# EAGLE schematic main (EAGLE 7.3.0)
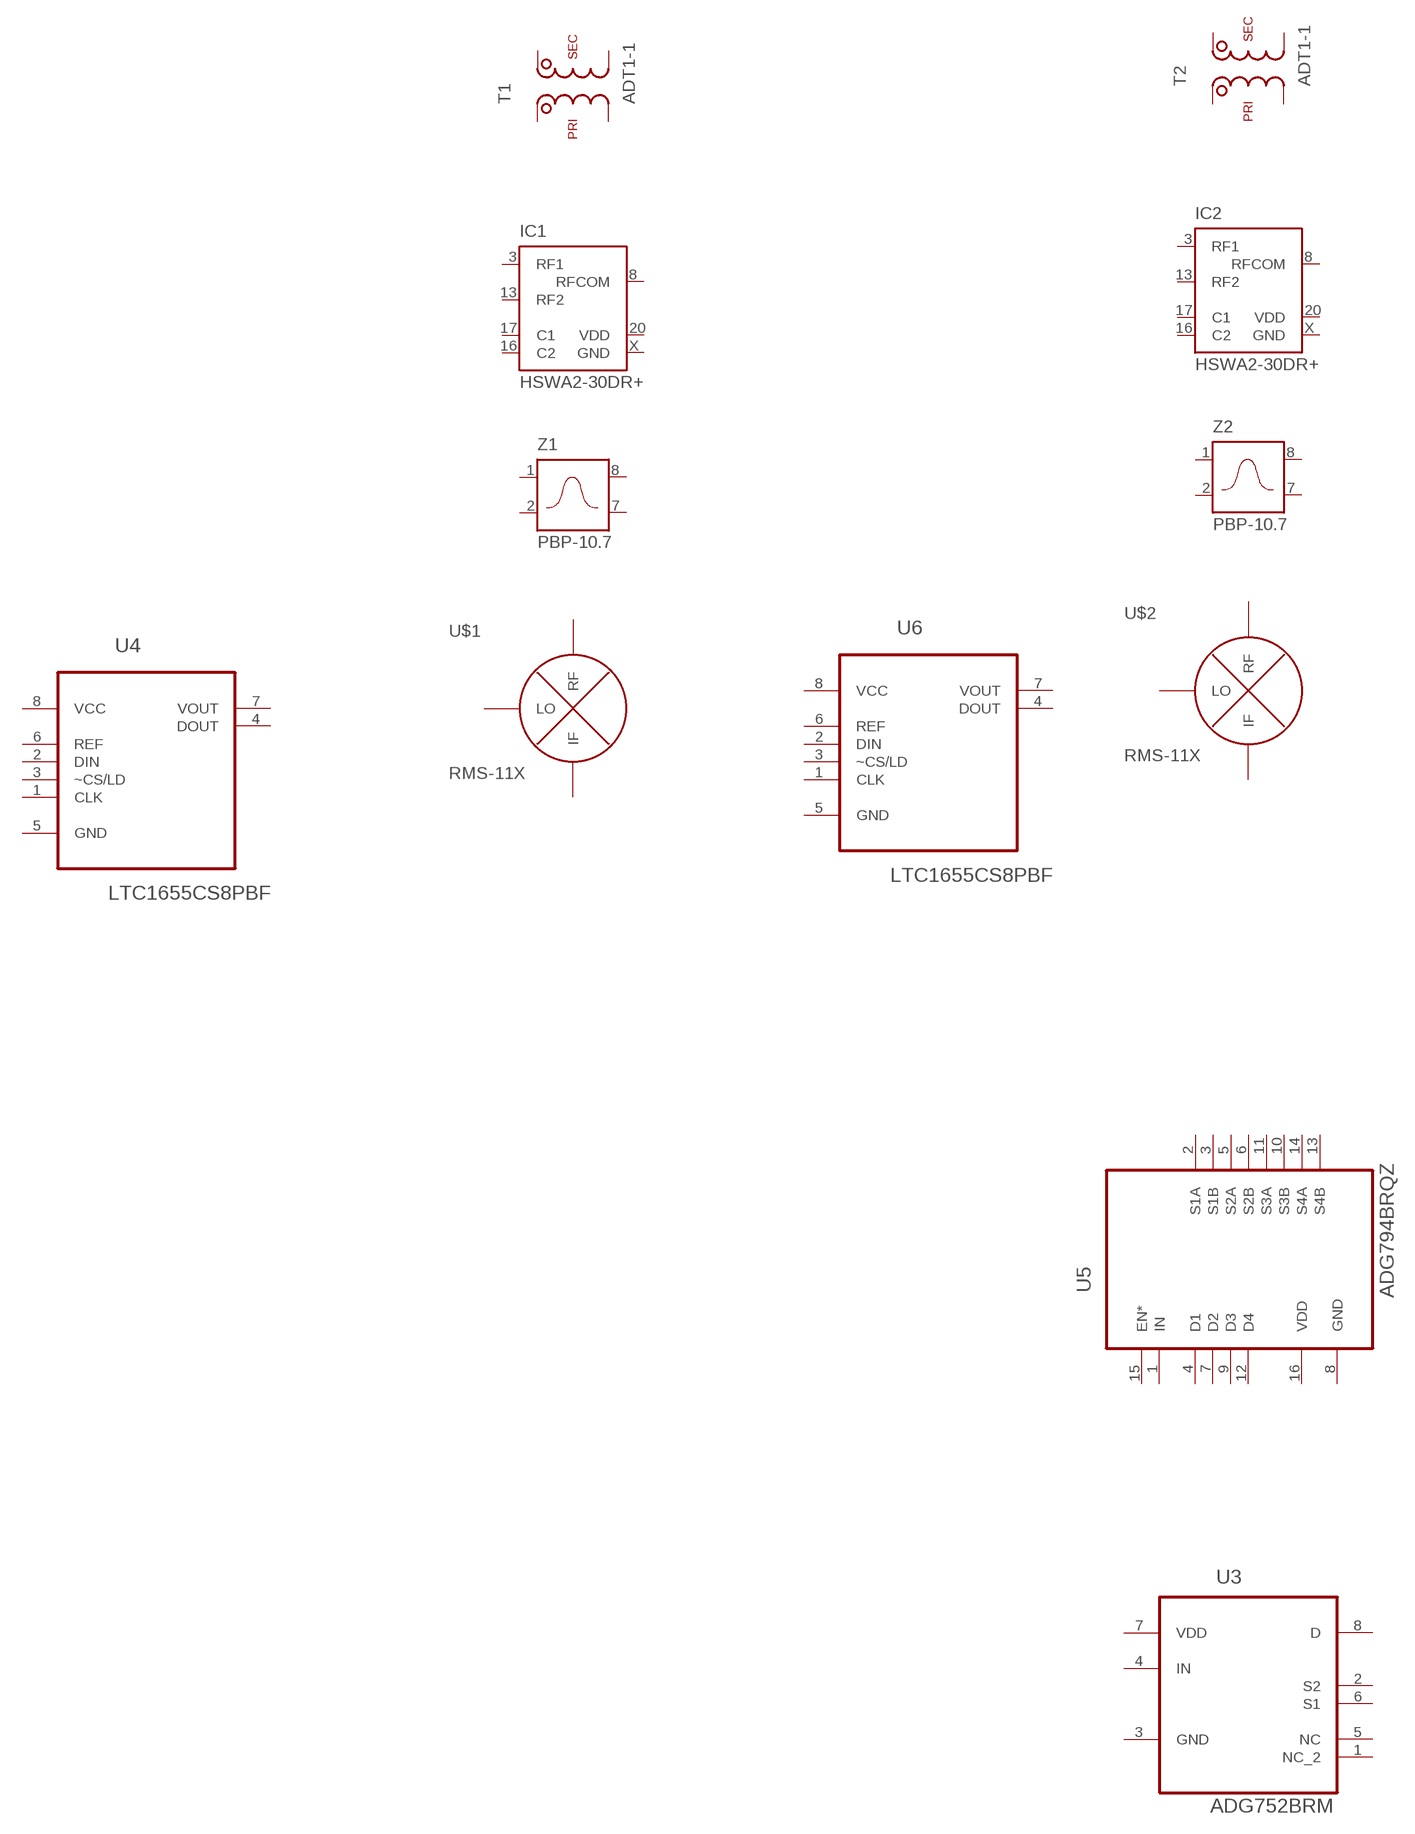
[diagram p0: schematic, sheet 1, part 1 of 3]
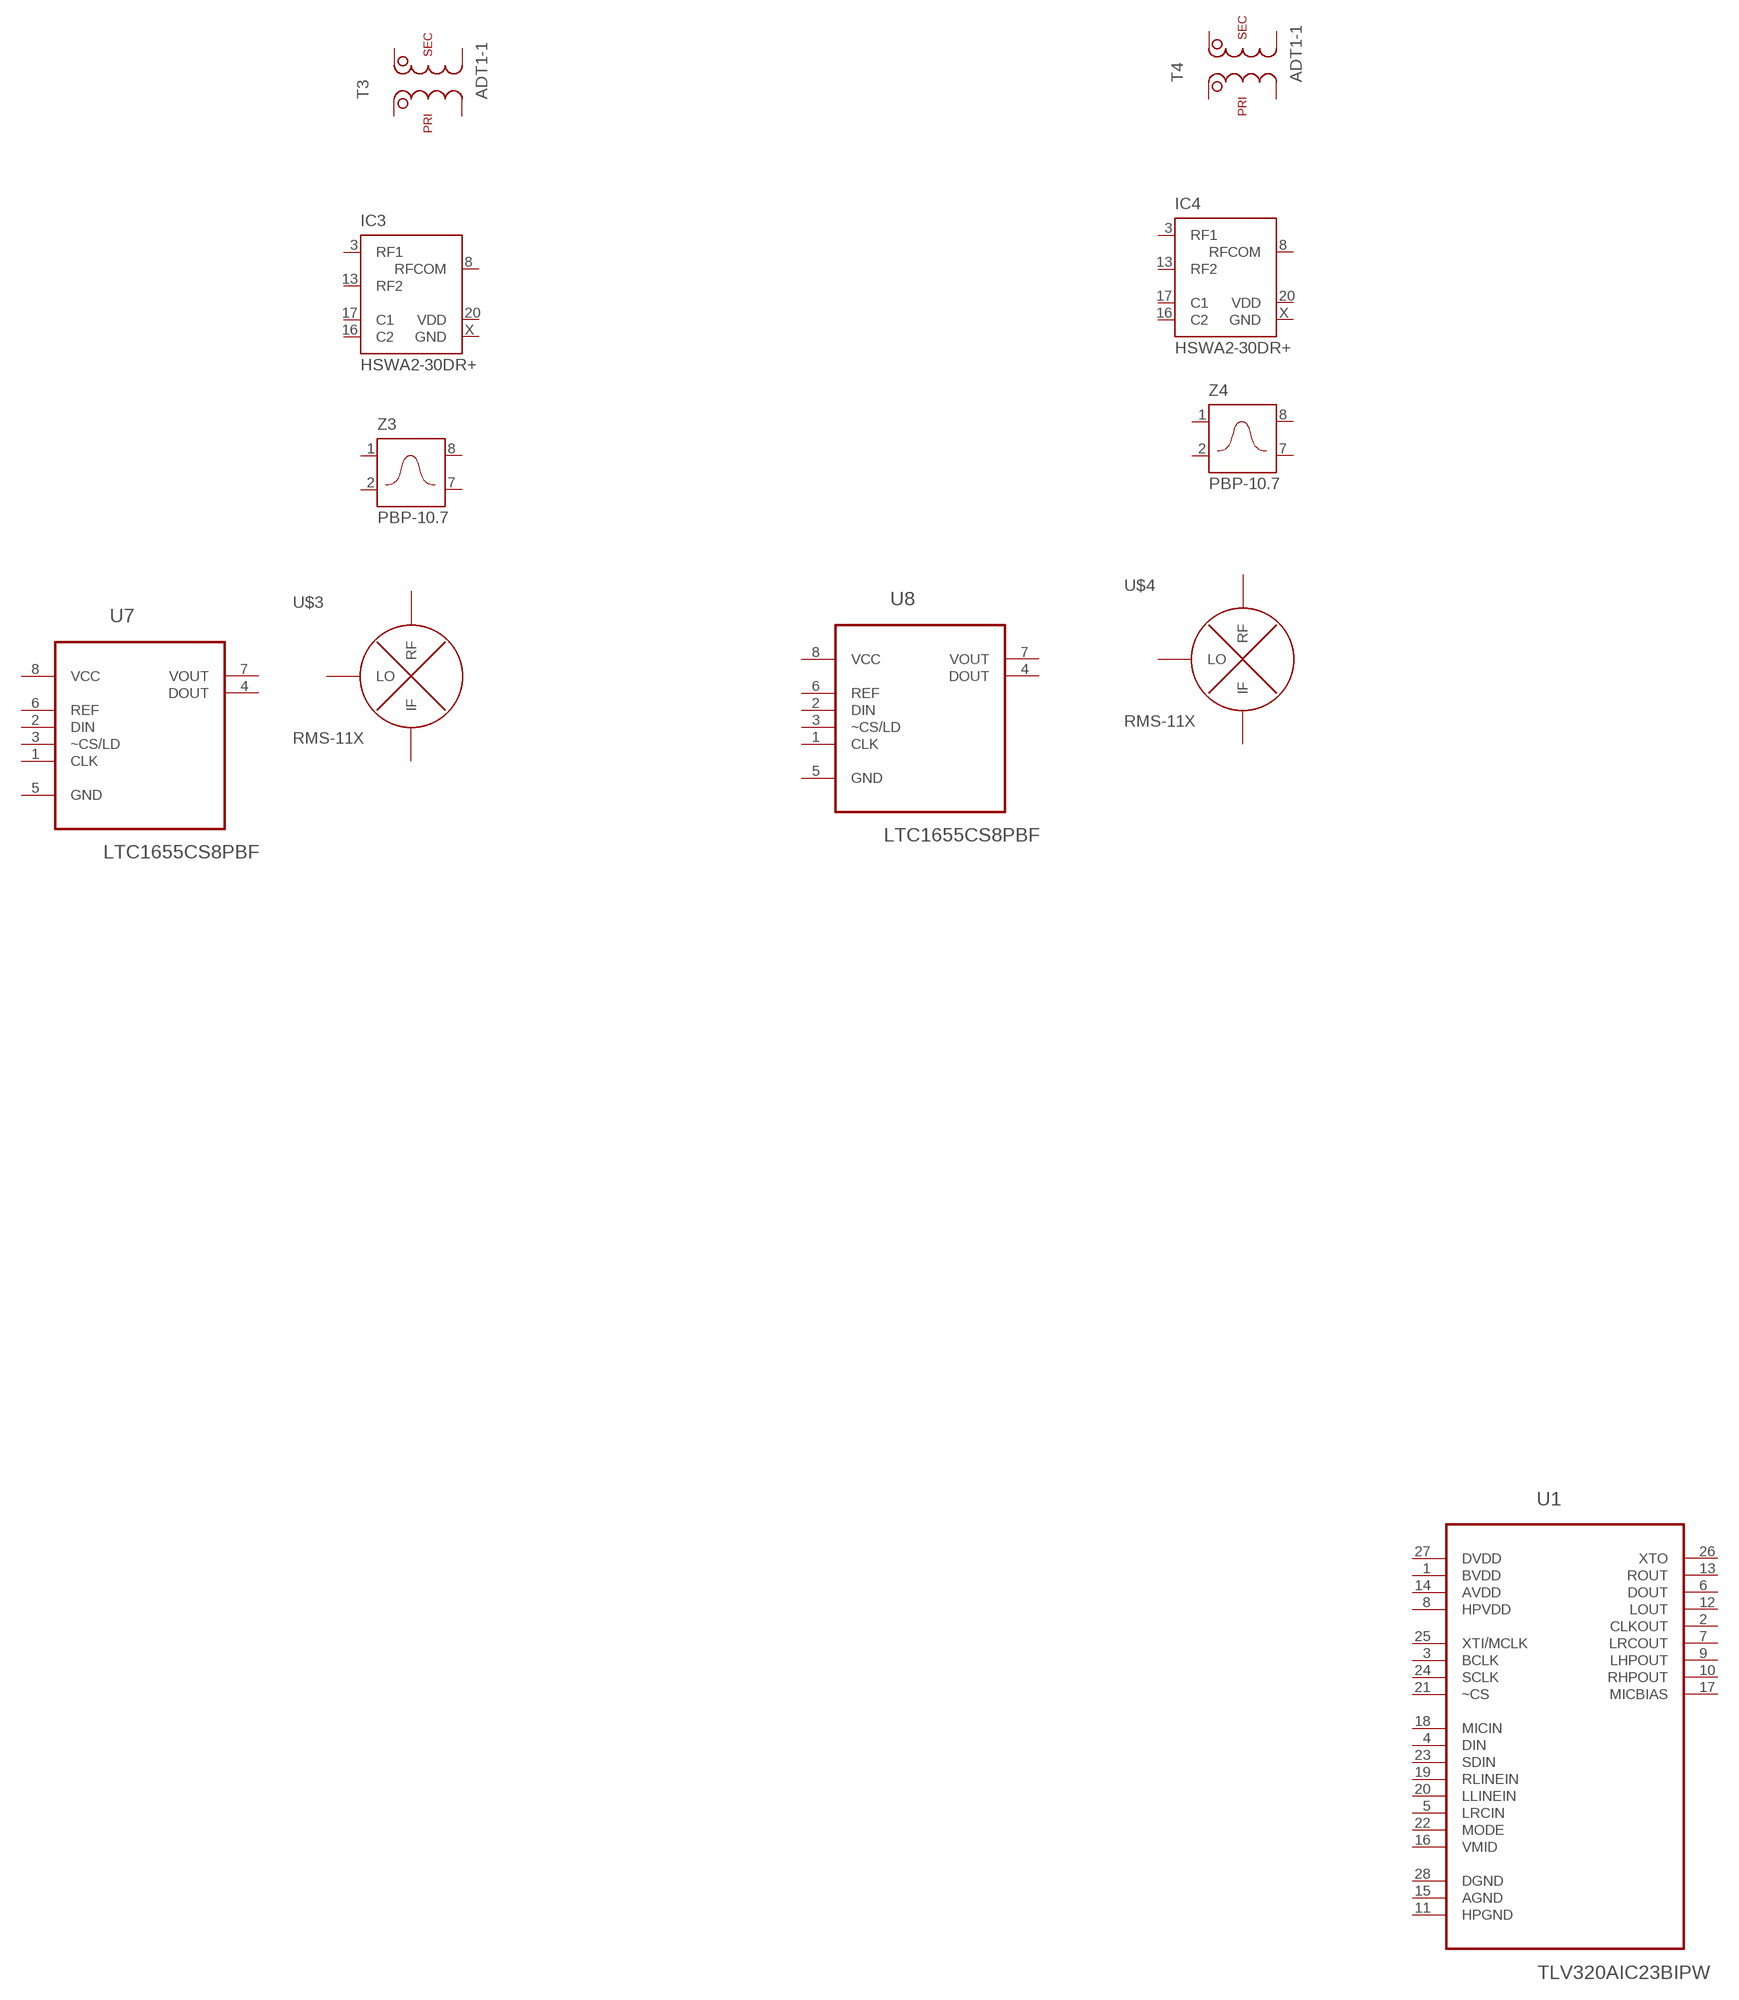
[diagram p1: schematic, sheet 1, part 2 of 3]
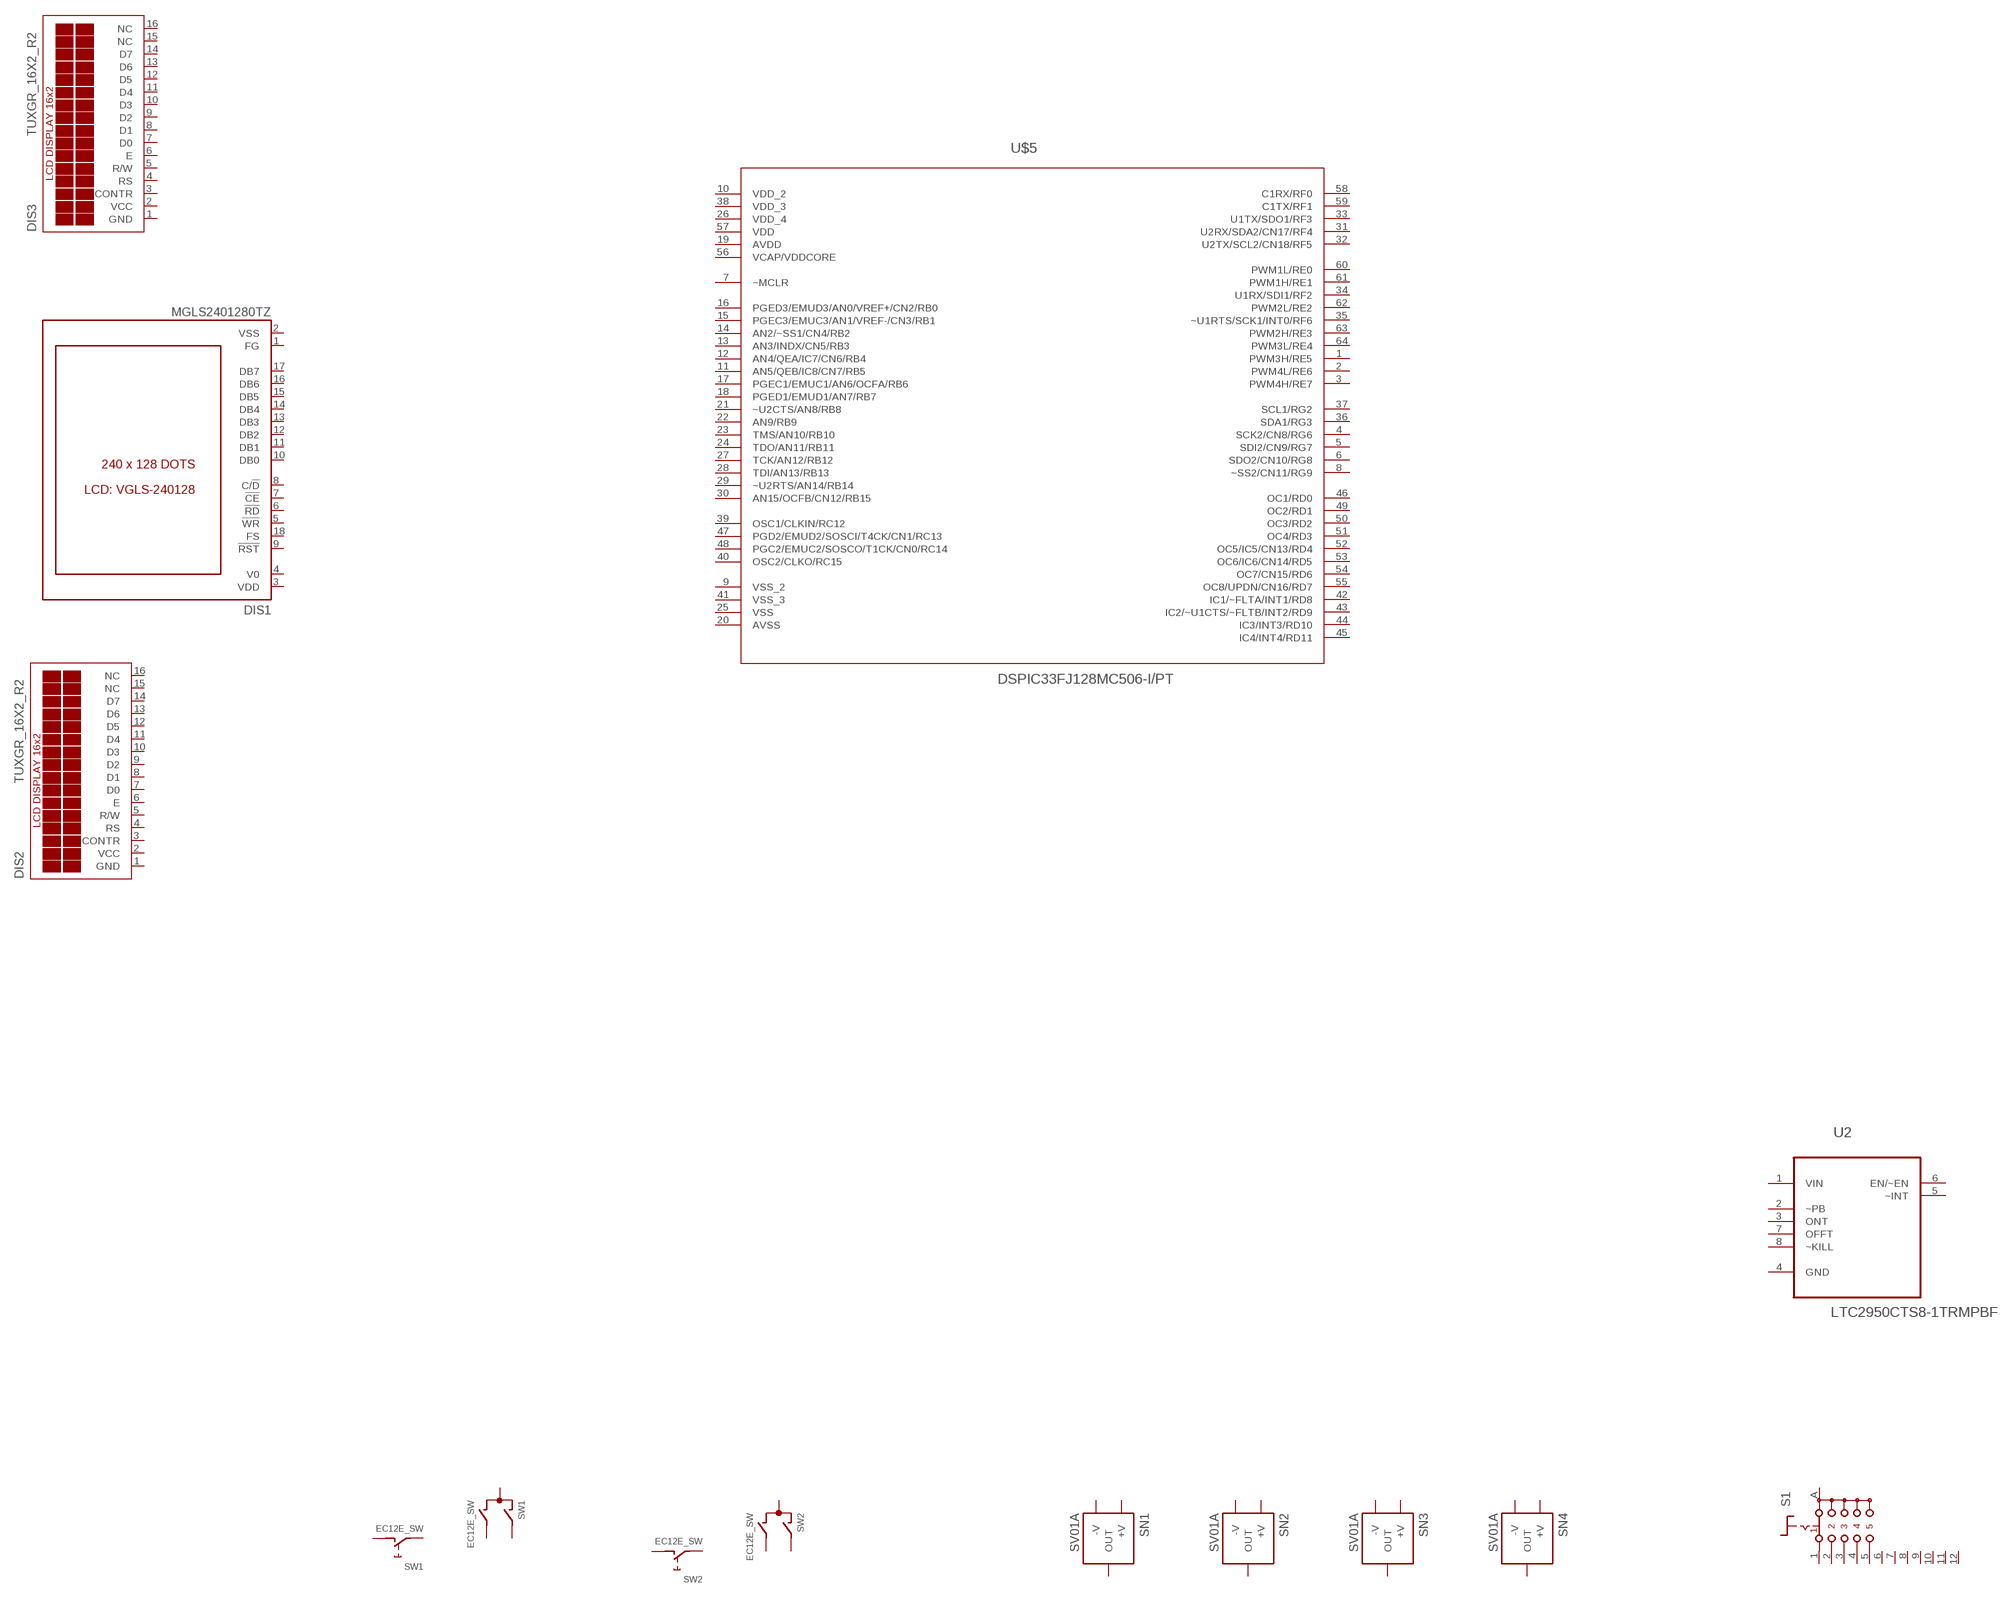
[diagram p2: schematic, sheet 1, part 3 of 3]

## Parts
DIS1  MGLS2401280TZ  [MGLS2401280TZ]
DIS2  TUXGR_16X2_R2  [TUXGR_16X2_R2]
DIS3  TUXGR_16X2_R2  [TUXGR_16X2_R2]
IC1  HSWA2-30DR+  [DG983-1]
IC2  HSWA2-30DR+  [DG983-1]
IC3  HSWA2-30DR+  [DG983-1]
IC4  HSWA2-30DR+  [DG983-1]
S1  CK101X12  [CK101X12]
SN1  SV01A  [SV01A]
SN2  SV01A  [SV01A]
SN3  SV01A  [SV01A]
SN4  SV01A  [SV01A]
SW1  EC12E_SW  [ALPS_EC12E_SW]
SW2  EC12E_SW  [ALPS_EC12E_SW]
T1  ADT1-1  [CD542]
T2  ADT1-1  [CD542]
T3  ADT1-1  [CD542]
T4  ADT1-1  [CD542]
U1  TLV320AIC23BIPW  [SOP65P640X120-28N]
U2  LTC2950CTS8-1TRMPBF  [SOT65P280X100-8N]
U3  ADG752BRM  [SOP65P490X110-8N]
U4  LTC1655CS8PBF  [SOIC127P600X175-8N]
U5  ADG794BRQZ  [SOP635P600X190-16N]
U6  LTC1655CS8PBF  [SOIC127P600X175-8N]
U7  LTC1655CS8PBF  [SOIC127P600X175-8N]
U8  LTC1655CS8PBF  [SOIC127P600X175-8N]
U$1  RMS-11X  [TT240]
U$2  RMS-11X  [TT240]
U$3  RMS-11X  [TT240]
U$4  RMS-11X  [TT240]
U$5  DSPIC33FJ128MC506-I/PT  [QFP80P1200X1200X120-64N]
Z1  PBP-10.7  [A01]
Z2  PBP-10.7  [A01]
Z3  PBP-10.7  [A01]
Z4  PBP-10.7  [A01]
Unconnected: DIS1.1(FG) DIS1.2(VSS) DIS1.3(VDD) DIS1.4(V0) DIS1.5(!WR) DIS1.6(!RD) DIS1.7(!CE) DIS1.8(C/!D) DIS1.9(!RST) DIS1.10(DB0) DIS1.11(DB1) DIS1.12(DB2) DIS1.13(DB3) DIS1.14(DB4) DIS1.15(DB5) DIS1.16(DB6) DIS1.17(DB7) DIS1.18(FS) DIS2.3(CONTR) DIS2.4(RS) DIS2.5(R/W) DIS2.6(E) DIS2.7(D0) DIS2.8(D1) DIS2.9(D2) DIS2.10(D3) DIS2.11(D4) DIS2.12(D5) DIS2.13(D6) DIS2.14(D7) DIS2.15(NC) DIS2.16(NC) DIS3.3(CONTR) DIS3.4(RS) DIS3.5(R/W) DIS3.6(E) DIS3.7(D0) DIS3.8(D1) DIS3.9(D2) DIS3.10(D3) DIS3.11(D4) DIS3.12(D5) DIS3.13(D6) DIS3.14(D7) DIS3.15(NC) DIS3.16(NC) IC1.3(RF1) IC1.8(RFCOM) IC1.13(RF2) IC1.16(C2) IC1.17(C1) IC1.20(VDD) IC2.3(RF1) IC2.8(RFCOM) IC2.13(RF2) IC2.16(C2) IC2.17(C1) IC2.20(VDD) IC3.3(RF1) IC3.8(RFCOM) IC3.13(RF2) IC3.16(C2) IC3.17(C1) IC3.20(VDD) IC4.3(RF1) IC4.8(RFCOM) IC4.13(RF2) IC4.16(C2) IC4.17(C1) IC4.20(VDD) S1.1 S1.2 S1.3 S1.4 S1.5 S1.6 S1.7 S1.8 S1.9 S1.10 S1.11 S1.12 S1.A SN1.1(-V) SN1.2(OUT) SN1.3(+V) SN2.1(-V) SN2.2(OUT) SN2.3(+V) SN3.1(-V) SN3.2(OUT) SN3.3(+V) SN4.1(-V) SN4.2(OUT) SN4.3(+V) SW1.A SW1.B SW1.C SW1.D SW1.E SW1.GND1(G) SW1.GND2(G) SW2.A SW2.B SW2.C SW2.D SW2.E SW2.GND1(G) SW2.GND2(G) T1.1(P2) T1.2(NC) T1.3(P1) T1.4(S1) T1.5(NC) T1.6(S2) T2.1(P2) T2.2(NC) T2.3(P1) T2.4(S1) T2.5(NC) T2.6(S2) T3.1(P2) T3.2(NC) T3.3(P1) T3.4(S1) T3.5(NC) T3.6(S2) T4.1(P2) T4.2(NC) T4.3(P1) T4.4(S1) T4.5(NC) T4.6(S2) U1.2(CLKOUT) U1.3(BCLK) U1.4(DIN) U1.5(LRCIN) U1.6(DOUT) U1.7(LRCOUT) U1.9(LHPOUT) U1.10(RHPOUT) U1.11(HPGND) U1.12(LOUT) U1.13(ROUT) U1.16(VMID) U1.17(MICBIAS) U1.18(MICIN) U1.19(RLINEIN) U1.20(LLINEIN) U1.21(~CS) U1.22(MODE) U1.23(SDIN) U1.24(SCLK) U1.25(XTI/MCLK) U1.26(XTO) U1.28(DGND) U2.2(~PB) U2.3(ONT) U2.4(GND) U2.5(~INT) U2.6(EN/~EN) U2.7(OFFT) U2.8(~KILL) U3.1(NC_2) U3.2(S2) U3.3(GND) U3.4(IN) U3.5(NC) U3.6(S1) U3.8(D) U4.1(CLK) U4.2(DIN) U4.3(~CS/LD) U4.4(DOUT) U4.5(GND) U4.6(REF) U4.7(VOUT) U5.1(IN) U5.2(S1A) U5.3(S1B) U5.4(D1) U5.5(S2A) U5.6(S2B) U5.7(D2) U5.8(GND) U5.9(D3) U5.10(S3B) U5.11(S3A) U5.12(D4) U5.13(S4B) U5.14(S4A) U5.15(EN*) U6.1(CLK) U6.2(DIN) U6.3(~CS/LD) U6.4(DOUT) U6.5(GND) U6.6(REF) U6.7(VOUT) U7.1(CLK) U7.2(DIN) U7.3(~CS/LD) U7.4(DOUT) U7.5(GND) U7.6(REF) U7.7(VOUT) U8.1(CLK) U8.2(DIN) U8.3(~CS/LD) U8.4(DOUT) U8.5(GND) U8.6(REF) U8.7(VOUT) U$1.P$1(LO) U$1.P$4(IF) U$1.P$5(RF) U$2.P$1(LO) U$2.P$4(IF) U$2.P$5(RF) U$3.P$1(LO) U$3.P$4(IF) U$3.P$5(RF) U$4.P$1(LO) U$4.P$4(IF) U$4.P$5(RF) U$5.1(PWM3H/RE5) U$5.2(PWM4L/RE6) U$5.3(PWM4H/RE7) U$5.4(SCK2/CN8/RG6) U$5.5(SDI2/CN9/RG7) U$5.6(SDO2/CN10/RG8) U$5.7(~MCLR) U$5.8(~SS2/CN11/RG9) U$5.11(AN5/QEB/IC8/CN7/RB5) U$5.12(AN4/QEA/IC7/CN6/RB4) U$5.13(AN3/INDX/CN5/RB3) U$5.14(AN2/~SS1/CN4/RB2) U$5.15(PGEC3/EMUC3/AN1/VREF-/CN3/RB1) U$5.16(PGED3/EMUD3/AN0/VREF+/CN2/RB0) U$5.17(PGEC1/EMUC1/AN6/OCFA/RB6) U$5.18(PGED1/EMUD1/AN7/RB7) U$5.21(~U2CTS/AN8/RB8) U$5.22(AN9/RB9) U$5.23(TMS/AN10/RB10) U$5.24(TDO/AN11/RB11) U$5.27(TCK/AN12/RB12) U$5.28(TDI/AN13/RB13) U$5.29(~U2RTS/AN14/RB14) U$5.30(AN15/OCFB/CN12/RB15) U$5.31(U2RX/SDA2/CN17/RF4) U$5.32(U2TX/SCL2/CN18/RF5) U$5.33(U1TX/SDO1/RF3) U$5.34(U1RX/SDI1/RF2) U$5.35(~U1RTS/SCK1/INT0/RF6) U$5.36(SDA1/RG3) U$5.37(SCL1/RG2) U$5.39(OSC1/CLKIN/RC12) U$5.40(OSC2/CLKO/RC15) U$5.42(IC1/~FLTA/INT1/RD8) U$5.43(IC2/~U1CTS/~FLTB/INT2/RD9) U$5.44(IC3/INT3/RD10) U$5.45(IC4/INT4/RD11) U$5.46(OC1/RD0) U$5.47(PGD2/EMUD2/SOSCI/T4CK/CN1/RC13) U$5.48(PGC2/EMUC2/SOSCO/T1CK/CN0/RC14) U$5.49(OC2/RD1) U$5.50(OC3/RD2) U$5.51(OC4/RD3) U$5.52(OC5/IC5/CN13/RD4) U$5.53(OC6/IC6/CN14/RD5) U$5.54(OC7/CN15/RD6) U$5.55(OC8/UPDN/CN16/RD7) U$5.58(C1RX/RF0) U$5.59(C1TX/RF1) U$5.60(PWM1L/RE0) U$5.61(PWM1H/RE1) U$5.62(PWM2L/RE2) U$5.63(PWM2H/RE3) U$5.64(PWM3L/RE4) Z1.1(IN) Z1.2(GND) Z1.7(GND) Z1.8(OUT) Z2.1(IN) Z2.2(GND) Z2.7(GND) Z2.8(OUT) Z3.1(IN) Z3.2(GND) Z3.7(GND) Z3.8(OUT) Z4.1(IN) Z4.2(GND) Z4.7(GND) Z4.8(OUT)

## Power pins joined to a net without a drawn wire
AGND: U1.15(AGND)
AVDD: U1.14(AVDD) U$5.19(AVDD)
AVSS: U$5.20(AVSS)
BVDD: U1.1(BVDD)
DVDD: U1.27(DVDD)
GND: DIS2.1(GND) DIS3.1(GND) IC1.1(GND) IC1.2(GND) IC1.4(GND) IC1.5(GND) IC1.6(GND) IC1.7(GND) IC1.9(GND) IC1.10(GND) IC1.11(GND) IC1.12(GND) IC1.14(GND) IC1.15(GND) IC1.18(GND) IC1.19(GND) IC1.X(GND) IC2.1(GND) IC2.2(GND) IC2.4(GND) IC2.5(GND) IC2.6(GND) IC2.7(GND) IC2.9(GND) IC2.10(GND) IC2.11(GND) IC2.12(GND) IC2.14(GND) IC2.15(GND) IC2.18(GND) IC2.19(GND) IC2.X(GND) IC3.1(GND) IC3.2(GND) IC3.4(GND) IC3.5(GND) IC3.6(GND) IC3.7(GND) IC3.9(GND) IC3.10(GND) IC3.11(GND) IC3.12(GND) IC3.14(GND) IC3.15(GND) IC3.18(GND) IC3.19(GND) IC3.X(GND) IC4.1(GND) IC4.2(GND) IC4.4(GND) IC4.5(GND) IC4.6(GND) IC4.7(GND) IC4.9(GND) IC4.10(GND) IC4.11(GND) IC4.12(GND) IC4.14(GND) IC4.15(GND) IC4.18(GND) IC4.19(GND) IC4.X(GND) U$1.P$2(GND) U$1.P$3(GND) U$1.P$6(GND) U$2.P$2(GND) U$2.P$3(GND) U$2.P$6(GND) U$3.P$2(GND) U$3.P$3(GND) U$3.P$6(GND) U$4.P$2(GND) U$4.P$3(GND) U$4.P$6(GND) Z1.3(GND) Z1.4(GND) Z1.5(GND) Z1.6(GND) Z2.3(GND) Z2.4(GND) Z2.5(GND) Z2.6(GND) Z3.3(GND) Z3.4(GND) Z3.5(GND) Z3.6(GND) Z4.3(GND) Z4.4(GND) Z4.5(GND) Z4.6(GND)
HPVDD: U1.8(HPVDD)
VCAP/VDDCORE: U$5.56(VCAP/VDDCORE)
VCC: DIS2.2(VCC) DIS3.2(VCC) U4.8(VCC) U6.8(VCC) U7.8(VCC) U8.8(VCC)
VDD: U3.7(VDD) U5.16(VDD) U$5.57(VDD)
VDD_2: U$5.10(VDD_2)
VDD_3: U$5.38(VDD_3)
VDD_4: U$5.26(VDD_4)
VIN: U2.1(VIN)
VSS: U$5.25(VSS)
VSS_2: U$5.9(VSS_2)
VSS_3: U$5.41(VSS_3)

## Library data of the parts
DIS1 = display-lcd:MGLS2401280TZ: LCD Display 240 x 128 Dots Source: VARITRONIX LIMITED .. LCD_f1187192714.pdf; OC_FARNELL: 1183196; OC_NEWARK: unknown
DIS2 DIS3 = display-lcd:TUXGR_16X2_R2: Tuxgraphics LCD display 16x2 characters reflective, without background light Source: tuxgr_12x2_r2.pdf; OC_FARNELL: unknown; OC_NEWARK: unknown
IC1-IC4 = minicircuits:HSWA2-30DR+: SPDT RF SWITCH Absorptive RF Switch with internal driver Source: http://www.minicircuits.com .. HSWA2-30DR+.pdf; OC_FARNELL: unknown; OC_NEWARK: unknown
S1 = tango:CK101X12: ROTARY SWITCH C&K
SN1-SN4 = murata-sensor:SV01: Rotary Position Sensors SMD/Lead Dust-proof Type 12mm Size SV01 Series Source: http://www.murata.com/catalog/r50/el0595.pdf; OC_FARNELL: 1406648; OC_NEWARK: unknown
SW1 SW2 = switch-alps:EC12E_SW: ALPS rotary Encoder EC12E series with switch; MPN: EC12E2424407; OC_FARNELL: 1520813; OC_NEWARK: 74M1068
T1-T4 = minicircuits:ADT: Wide band RF transformer
U1 = Texas Instruments_By_element14_Batch_1:TLV320AIC23BIPW: stereo audio codec 8 to 96 khz with integrated headphone amplifiers; MPN: TLV320AIC23BIPW; OC_FARNELL: 1212374; OC_NEWARK: 32H6514; PACKAGE: TSSOP-28; SUPPLIER: Texas Instruments
U2 = LTC_By_element14_Batch_1:LTC2950CTS8-1TRMPBF: Push Button On/Off Controller; MPN: LTC2950CTS8-1#TRMPBF; OC_FARNELL: 1668770; OC_NEWARK: 12P6551; PACKAGE: TSOT-23-8; SUPPLIER: Linear Technology
U3 = ADI-Phase-2:ADG752BRM: CMOS, Low Voltage, RF/ Video, SPDT Switch; MPN: ADG752BRM; OC_FARNELL: 1465252; OC_NEWARK: unknown; PACKAGE: mSOIC-8; SUPPLIER: Analog Devices
U4 U6-U8 = LTC_By_element14_Batch_1:LTC1655CS8PBF: 16-Bit Rail-to-Rail Micropower DAC; MPN: LTC1655CS8#PBF; OC_FARNELL: 1663654; OC_NEWARK: 56M2907; PACKAGE: SOIC-8; SUPPLIER: Linear Technology
U5 = ADI-Phase-2:ADG794BRQZ: Low Voltage, 300 MHz Quad 2:1 Mux Analog HDTV Audio/Video Switch; MPN: ADG794BRQZ; OC_FARNELL: 1078226; OC_NEWARK: 19M0696; PACKAGE: QSOP-16; SUPPLIER: Analog Devices
U$1-U$4 = minicircuits:RMS-11X: Frequency mixer LO power level: 7 dBm LO/RF: 5 MHz - 1900 MHz IF: 2 MHz - 1000 MHz Max conversion loss: 9.8 dB Absolute maximum rating: RF power: 100 mW IF current: 40 mA
U$5 = Microchip_By_element14_Batch_1:DSPIC33FJ128MC506-I/PT: DSC, 16BIT, 128KB 40MHZ 3.6V; DESCRIPTION: DSC, 16BIT, 128KB 40MHZ 3.6V; MPN: DSPIC33FJ128MC506-I/PT; OC_FARNELL: 1294839; OC_NEWARK: 56K6739; PACKAGE: TQFP-64; SUPPLIER: Microchip
Z1-Z4 = minicircuits:PBP-10.7: Band Pass Filter Source: minicircuits.com .. PBP-10.7+.pdf; OC_FARNELL: unknown; OC_NEWARK: unknown